# EAGLE design Lenovo_P15_17 (EAGLE 9.6.2)
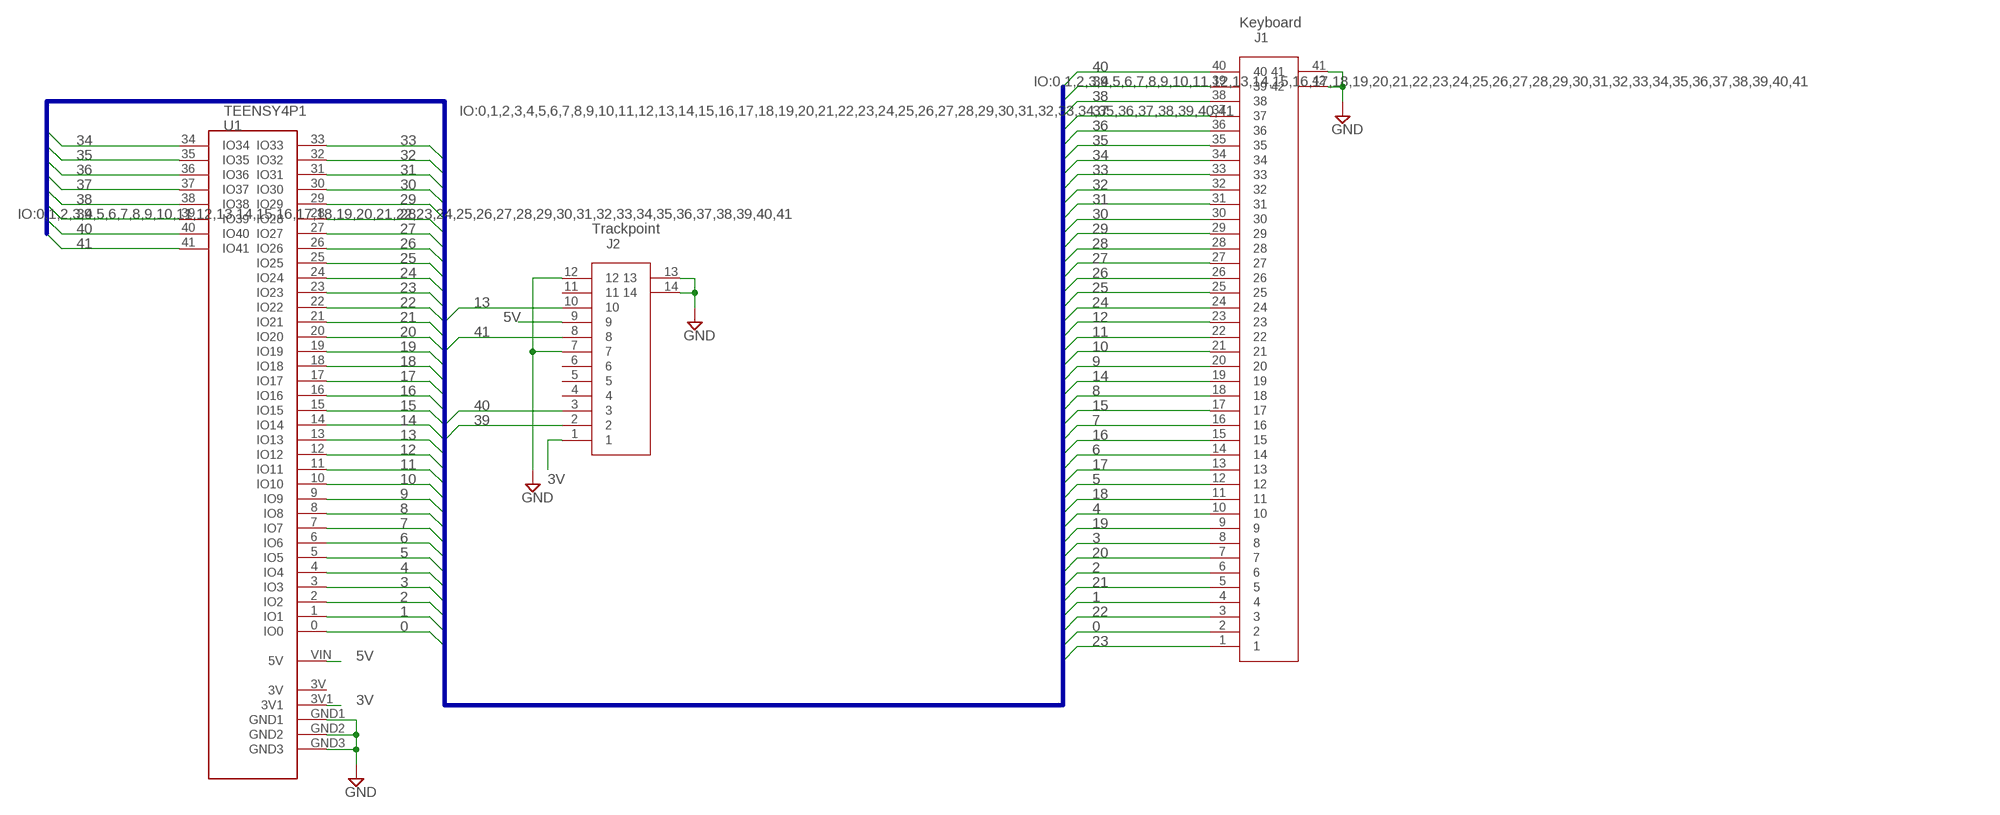
[diagram p0: schematic, sheet 1]

## Parts
J1  FPC34_P5MM  [FPC34_P5MM]
J2  FPC12  [FPC12]
U1  TEENSY4P1  TEENSY4P1_CUTOUT  [TEENSY4P0_CUTOUT]

## Nets
0: J1.2 U1.0(IO0)
1: J1.4 U1.1(IO1)
2: J1.6 U1.2(IO2)
3: J1.8 U1.3(IO3)
3V: J2.1 U1.3V1
4: J1.10 U1.4(IO4)
5: J1.12 U1.5(IO5)
5V: J2.9 U1.VIN(5V)
6: J1.14 U1.6(IO6)
7: J1.16 U1.7(IO7)
8: J1.18 U1.8(IO8)
9: J1.20 U1.9(IO9)
10: J1.21 U1.10(IO10)
11: J1.22 U1.11(IO11)
12: J1.23 U1.12(IO12)
13: J2.10 U1.13(IO13)
14: J1.19 U1.14(IO14)
15: J1.17 U1.15(IO15)
16: J1.15 U1.16(IO16)
17: J1.13 U1.17(IO17)
18: J1.11 U1.18(IO18)
19: J1.9 U1.19(IO19)
20: J1.7 U1.20(IO20)
21: J1.5 U1.21(IO21)
22: J1.3 U1.22(IO22)
23: J1.1 U1.23(IO23)
24: J1.24 U1.24(IO24)
25: J1.25 U1.25(IO25)
26: J1.26 U1.26(IO26)
27: J1.27 U1.27(IO27)
28: J1.28 U1.28(IO28)
29: J1.29 U1.29(IO29)
30: J1.30 U1.30(IO30)
31: J1.31 U1.31(IO31)
32: J1.32 U1.32(IO32)
33: J1.33 U1.33(IO33)
34: J1.34 U1.34(IO34)
35: J1.35 U1.35(IO35)
36: J1.36 U1.36(IO36)
37: J1.37 U1.37(IO37)
38: J1.38 U1.38(IO38)
39: J1.39 J2.2 U1.39(IO39)
40: J1.40 J2.3 U1.40(IO40)
41: J2.8 U1.41(IO41)
GND: J1.41 J1.42 J2.7 J2.12 J2.13 J2.14 U1.GND1 U1.GND2 U1.GND3
Unconnected: J2.4 J2.5 J2.6 J2.11 U1.3V

## Buses
IO:0,1,2,3,4,5,6,7,8,9,10,11,12,13,14,15,16,17,18,19,20,21,22,23,24,25,26,27,28,29,30,31,32,33,34,35,36,37,38,39,40,41

## Notes on the sheet
- Keyboard
- Trackpoint

## Library data of the parts
J1 = FPC34_p5mm:FPC34_P5MM: Molex Right Angle FPC Connector 1mm pitch, bottom contacts with 32 pins. Molex Part Number DigiKey Part Number
J2 = FPC34:FPC12
U1 = TEENSY4P1_CUTOUT:TEENSY4P1_CUTOUT

## Board
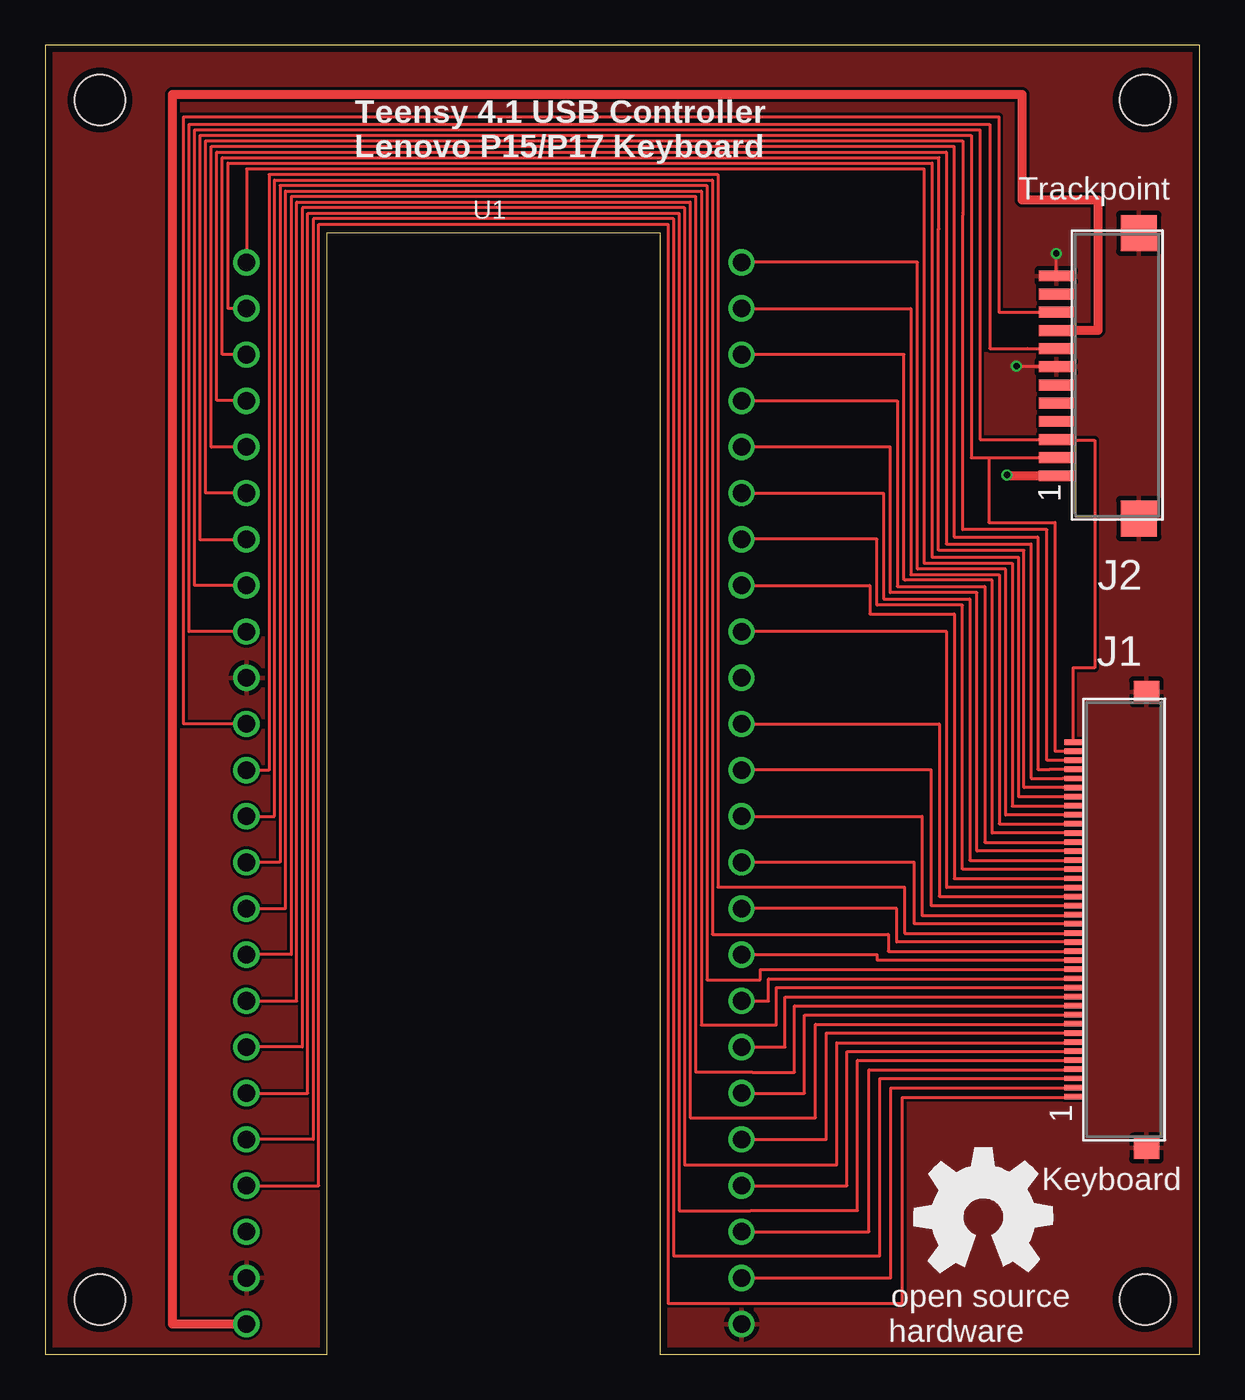
[diagram p1: board, top side]
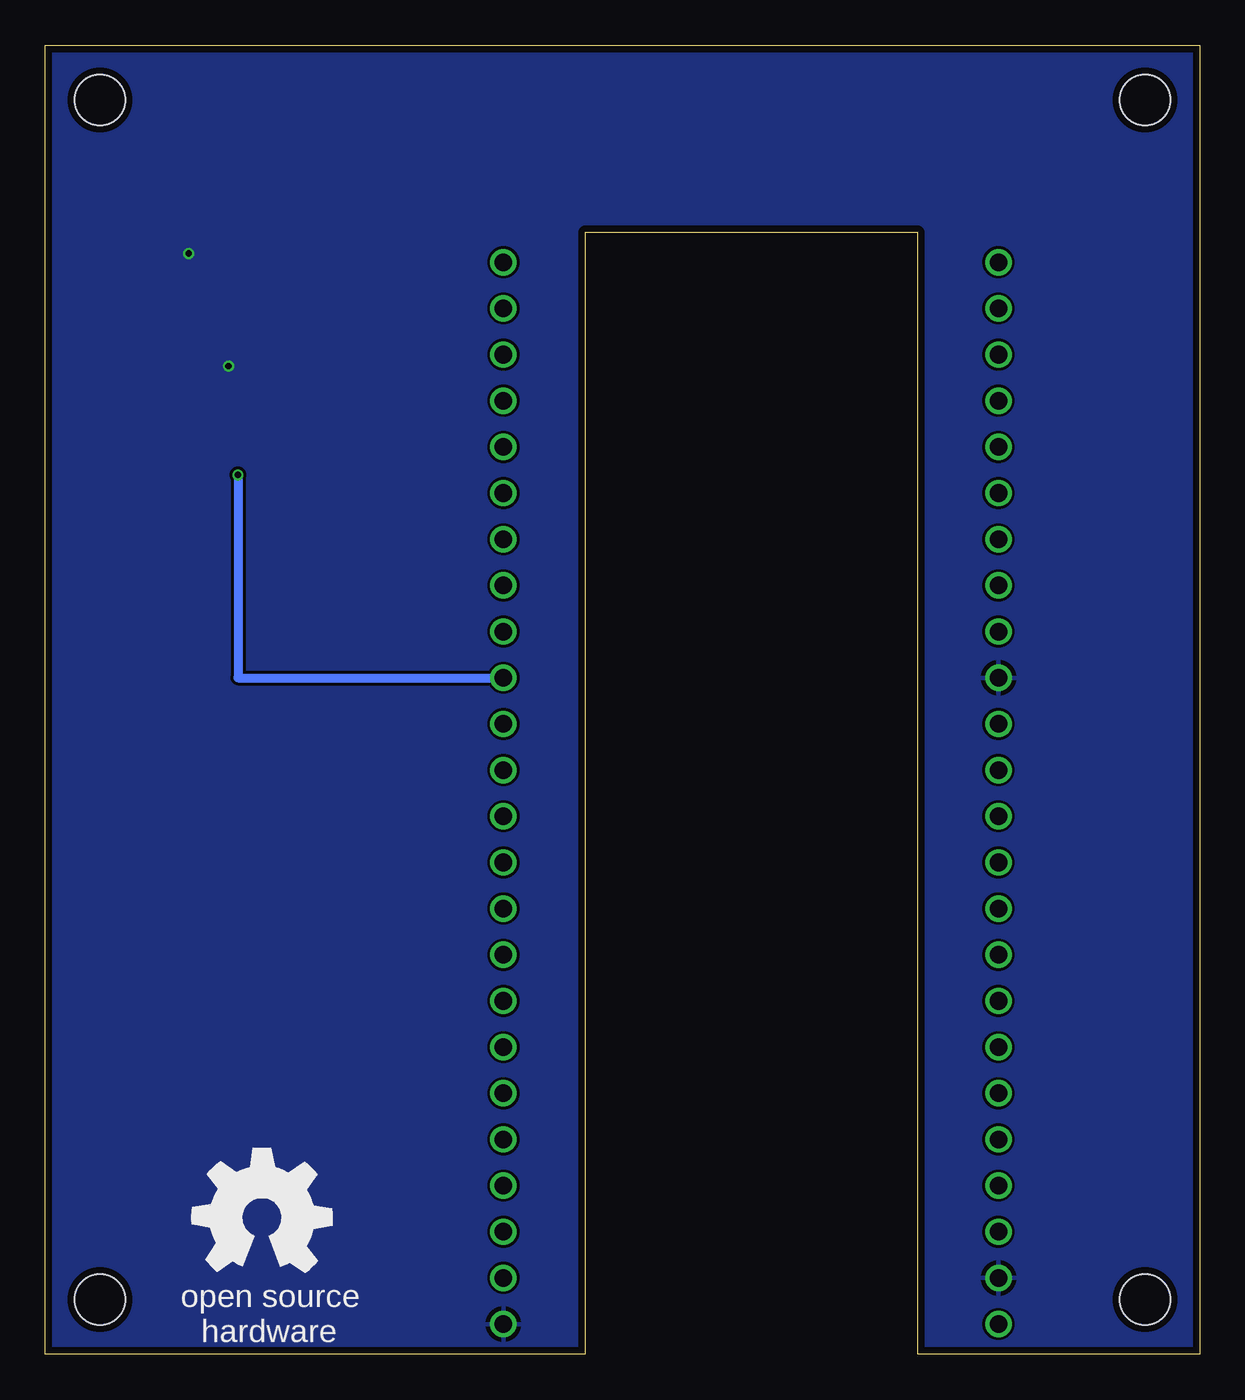
[diagram p2: board, bottom side, seen from below]

Size 63.5 x 72 mm. Coordinates in mm from the lower left corner, seen from the top.
Outline: 0,0 15.5,0 15.5,61.7 33.8,61.7 33.8,0 63.5,0 63.5,72 0,72 0,0
Copper layers (1*16): Top 0.035559375mm / dielectric 1.6mm / Bottom 0.035559375mm
Design rules "oshpark-2layer": minimum track width 6mil, minimum drill 10mil, track to track 6mil, track to pad 6mil, pad to pad 6mil, via to via 6mil, smd to smd 6mil, copper to edge 15mil, drill to drill 6mil, minimum pad ring 5mil, minimum via ring 5mil, stop-mask expansion 2.5mil, vias tented up to drill 0mil, thermal gap 10mil
Holes 2.8 mm at 3,3 60.5,3 3,69 60.5,69

### Footprints (pad centres in the part's own frame; a part is rotated, then mirrored left to right if it is on the bottom)
FPC34_P5MM = smd 0.3 x 1.1: 1 -13.7,3.5; 2 -13.2,3.5; 3 -12.7,3.5; 4 -12.2,3.5; 5 -11.7,3.5; 6 -11.2,3.5; 7 -10.7,3.5; 8 -10.2,3.5; 9 -9.7,3.5; 10 -9.2,3.5; 11 -8.7,3.5; 12 -8.2,3.5; 13 -7.7,3.5; 14 -7.2,3.5; 15 -6.7,3.5; 16 -6.2,3.5; 17 -5.7,3.5; 18 -5.2,3.5; 19 -4.7,3.5; 20 -4.2,3.5; 21 -3.7,3.5; 22 -3.2,3.5; 23 -2.7,3.5; 24 -2.2,3.5; 25 -1.7,3.5; 26 -1.2,3.5; 27 -0.7,3.5; 28 -0.2,3.5; 29 0.3,3.5; 30 0.8,3.5; 31 1.3,3.5; 32 1.8,3.5; 33 2.3,3.5; 34 2.8,3.5; 35 3.3,3.5; 36 3.8,3.5; 37 4.3,3.5; 38 4.8,3.5; 39 5.3,3.5; 40 5.8,3.5 | smd 1.2 x 1.4: 41 -16.53,-0.48; 42 8.57,-0.48
FPC12 = smd 0.6 x 1.9: 1 5.35,6.4; 2 6.35,6.4; 3 7.35,6.4; 4 8.35,6.4; 5 9.35,6.4; 6 10.35,6.4; 7 11.35,6.4; 8 12.35,6.4; 9 13.35,6.4; 10 14.35,6.4; 11 15.35,6.4; 12 16.35,6.4 | smd 2 x 2: 13 3,1.85; 14 18.7,1.85
TEENSY4P0_CUTOUT = drill 0.965: 0 -15.24,-13.62; 1 -12.7,-13.62; 2 -10.16,-13.62; 3 -7.62,-13.62; 3V -12.7,13.62; 3V1 17.78,-13.62; 4 -5.08,-13.62; 5 -2.54,-13.62; 6 0,-13.62; 7 2.54,-13.62; 8 5.08,-13.62; 9 7.62,-13.62; 10 10.16,-13.62; 11 12.7,-13.62; 12 15.24,-13.62; 13 15.24,13.62; 14 12.7,13.62; 15 10.16,13.62; 16 7.62,13.62; 17 5.08,13.62; 18 2.54,13.62; 19 0,13.62; 20 -2.54,13.62; 21 -5.08,13.62; 22 -7.62,13.62; 23 -10.16,13.62; 24 20.32,-13.62; 25 22.86,-13.62; 26 25.4,-13.62; 27 27.94,-13.62; 28 30.48,-13.62; 29 33.02,-13.62; 30 35.56,-13.62; 31 38.1,-13.62; 32 40.64,-13.62; 33 40.64,13.62; 34 38.1,13.62; 35 35.56,13.62; 36 33.02,13.62; 37 30.48,13.62; 38 27.94,13.62; 39 25.4,13.62; 40 22.86,13.62; 41 20.32,13.62; GND1 -17.78,-13.62; GND2 -15.24,13.62; GND3 17.78,13.62; VIN -17.78,13.62

### Placement (x,y rotation side)
J1  60.1,27.87 90 top
J2  62.01,42.97 90 top
U1  24.68,19.43 90 top
U$1  [OSHW_8MM]  51.58,7.52 0 top
U$2  [OSHW_8MM]  51.56,7.51 0 top

### Tracks (layer width: path | path; a pad name or v marks a point on that pad's centre or on a via)
0
  Top 0.152: J1.2 56.06,14.64 46.51,14.64 46.51,4.19 U1.0
1
  Top 0.152: J1.4 56.02,15.65 45.32,15.65 45.32,6.73 U1.1
2
  Top 0.152: J1.6 56.03,16.65 44.1,16.65 44.1,9.27 U1.2
3
  Top 0.152: U1.3 42.96,11.81 42.96,17.67 J1.8
3V  (via drill 0.35)
  Top 0.508: J2.1 52.93,48.32 52.93,48.37 v52.91,48.37
  Bottom 0.508: v52.91,48.37 52.91,37.21 U1.3V1
4
  Top 0.152: J1.10 56.03,18.65 41.77,18.65 41.77,14.35 U1.4
5
  Top 0.152: J1.12 56.05,19.64 40.7,19.64 40.7,16.89 U1.5
5V
  Top 0.508: U1.VIN 7,1.65 7,69.29 53.74,69.29 53.74,63.5 57.92,63.5 57.92,56.32 J2.9
6
  Top 0.152: J1.14 56.02,20.65 39.79,20.65 39.79,19.43 U1.6
7
  Top 0.152: J1.16 45.77,21.67 45.77,21.97 U1.7
8
  Top 0.152: U1.8 38.78,24.51 38.9,24.51 46.84,24.51 46.84,22.67 J1.18
9
  Top 0.152: U1.9 38.65,27.05 38.95,27.05 47.8,27.05 47.8,23.67 J1.20
10
  Top 0.152: J1.21 56.06,24.13 48.23,24.13 48.23,29.59 U1.10
11
  Top 0.152: J1.22 48.74,24.67 48.74,32.15 38.3,32.15 U1.11
12
  Top 0.152: J1.23 56.02,25.18 49.18,25.18 49.18,34.67 U1.12
13
  Top 0.152: U1.13 7.6,34.67 7.6,68.07 52.47,68.07 52.47,57.32 J2.10
14
  Top 0.152: J1.19 56.09,23.15 47.27,23.15 47.27,25.7 37,25.7 37,64.9 12.3,64.9 12.3,32.12 U1.14
15
  Top 0.152: J1.17 56.04,22.16 46.37,22.16 46.37,23.1 36.7,23.1 36.7,64.6 12.6,64.6 12.6,29.59 U1.15
16
  Top 0.152: J1.15 56.06,21.16 39.33,21.16 39.33,20.6 36.39,20.6 36.39,64.29 12.91,64.29 12.91,27.05 U1.16
17
  Top 0.152: U1.17 13.21,24.51 13.21,63.99 36.09,63.99 36.09,18.1 40.21,18.1 40.21,20.17 J1.13
18
  Top 0.152: U1.18 13.52,21.98 13.52,63.68 35.78,63.68 35.78,15.5 38.85,15.5 38.9,15.5 41.22,15.5 41.22,19.17 J1.11
19
  Top 0.152: J1.9 56.03,18.15 42.37,18.15 42.37,13 35.48,13 35.48,63.38 13.82,63.38 13.82,19.43 U1.19
20
  Top 0.152: J1.7 56.03,17.13 43.54,17.13 43.54,10.4 35.17,10.4 35.17,63.07 14.13,63.07 14.13,16.89 U1.20
21
  Top 0.152: J1.5 56.04,16.16 44.68,16.16 44.68,7.9 38.8,7.9 38.8,7.89 34.87,7.89 34.87,62.77 14.43,62.77 14.43,14.35 U1.21
22
  Top 0.152: J1.3 56.03,15.16 45.9,15.16 45.9,5.4 34.56,5.4 34.56,62.46 14.74,62.46 14.74,11.81 U1.22
23
  Top 0.152: J1.1 56.07,14.12 47.15,14.12 47.15,2.79 39.1,2.79 34.26,2.79 34.26,62.16 15.04,62.16 15.04,9.27 U1.23
24
  Top 0.152: J1.24 49.59,25.67 49.59,39.75 U1.24
25
  Top 0.152: J1.25 56.04,26.16 50,26.16 50,40.72 45.35,40.72 45.35,42.29 U1.25
26
  Top 0.152: J1.26 50.46,26.67 50.46,41.2 45.76,41.2 45.76,44.83 U1.26
27
  Top 0.152: U1.27 46.11,47.37 46.11,41.55 50.85,41.55 50.85,27.17 J1.27
28
  Top 0.152: J1.28 51.26,27.67 51.26,41.89 46.48,41.89 46.48,49.91 U1.28
29
  Top 0.152: J1.29 56.04,28.16 51.68,28.16 51.68,42.24 46.87,42.24 46.87,52.45 U1.29
30
  Top 0.152: J1.30 52.09,28.67 52.09,42.58 47.3,42.58 47.3,42.59 47.24,42.59 47.24,54.99 U1.30
31
  Top 0.152: J1.31 56.02,29.18 52.48,29.18 52.48,42.88 47.61,42.88 47.61,57.53 U1.31
32
  Top 0.152: J1.32 56.02,29.65 52.84,29.65 52.84,43.19 47.98,43.19 47.98,60.07 U1.32
33
  Top 0.152: J1.33 56.04,30.15 53.19,30.15 53.19,43.52 48.34,43.52 48.34,65.2 11.06,65.2 U1.33
34
  Top 0.152: U1.34 10.04,57.53 10.04,65.53 48.78,65.53 48.78,43.85 53.53,43.85 53.53,30.67 J1.34
35
  Top 0.152: U1.35 9.73,54.99 9.73,65.83 49.16,65.83 49.16,61.91 49.14,61.91 49.14,44.21 53.84,44.21 53.84,31.17 56,31.17 J1.35
36
  Top 0.152: U1.36 11.06,52.46 9.43,52.46 9.43,66.14 49.57,66.14 49.57,44.58 54.22,44.58 54.22,31.67 55.97,31.67 J1.36
37
  Top 0.152: U1.37 11.04,49.89 9.12,49.89 9.12,66.44 49.98,66.44 49.98,44.96 54.59,44.96 54.59,32.17 55.25,32.17 J1.37
38
  Top 0.152: U1.38 11.06,47.38 8.82,47.38 8.82,66.75 50.47,66.75 50.47,62.78 50.47,62.65 50.47,45.36 55.1,45.36 55.1,32.67 55.34,32.67 J1.38
39
  Top 0.152: U1.39 11.02,44.79 8.51,44.79 8.51,67.05 50.93,67.05 50.93,49.32 51.9,49.32 | 51.9,49.32 J2.2 | 51.9,49.32 51.9,45.76 55.54,45.76 55.54,33.17 J1.39
40
  Top 0.152: U1.40 8.21,42.29 8.21,67.36 51.42,67.36 51.42,50.32 J2.3 55.61,50.28 57.73,50.28 57.73,37.75 56.53,37.75 56.53,33.67 J1.40
41
  Top 0.152: U1.41 7.9,39.75 7.9,67.66 51.95,67.66 51.95,55.32 54.03,55.32 J2.8
GND  (via drill 0.35)
  Top 0.152: U1.GND3 11.06,37.02 | J2.7 53.46,54.32 53.46,54.36 v53.43,54.36 | J2.12 v55.61,60.55 v55.62,60.55
  pour Top: 0,0 0,72 63.5,72 63.5,0 33.8,0 33.8,61.7 15.5,61.7 15.5,0
  pour Bottom: 0,0 0,72 63.48,72 63.48,0 33.8,0 33.8,61.7 15.5,61.7 15.5,0

### Text on the board
tPlace: Teensy 4.1 USB Controller / Lenovo P15/P17 Keyboard | Trackpoint | U1 | Keyboard